# Altium project THE_HAE_Project.PrjPcb
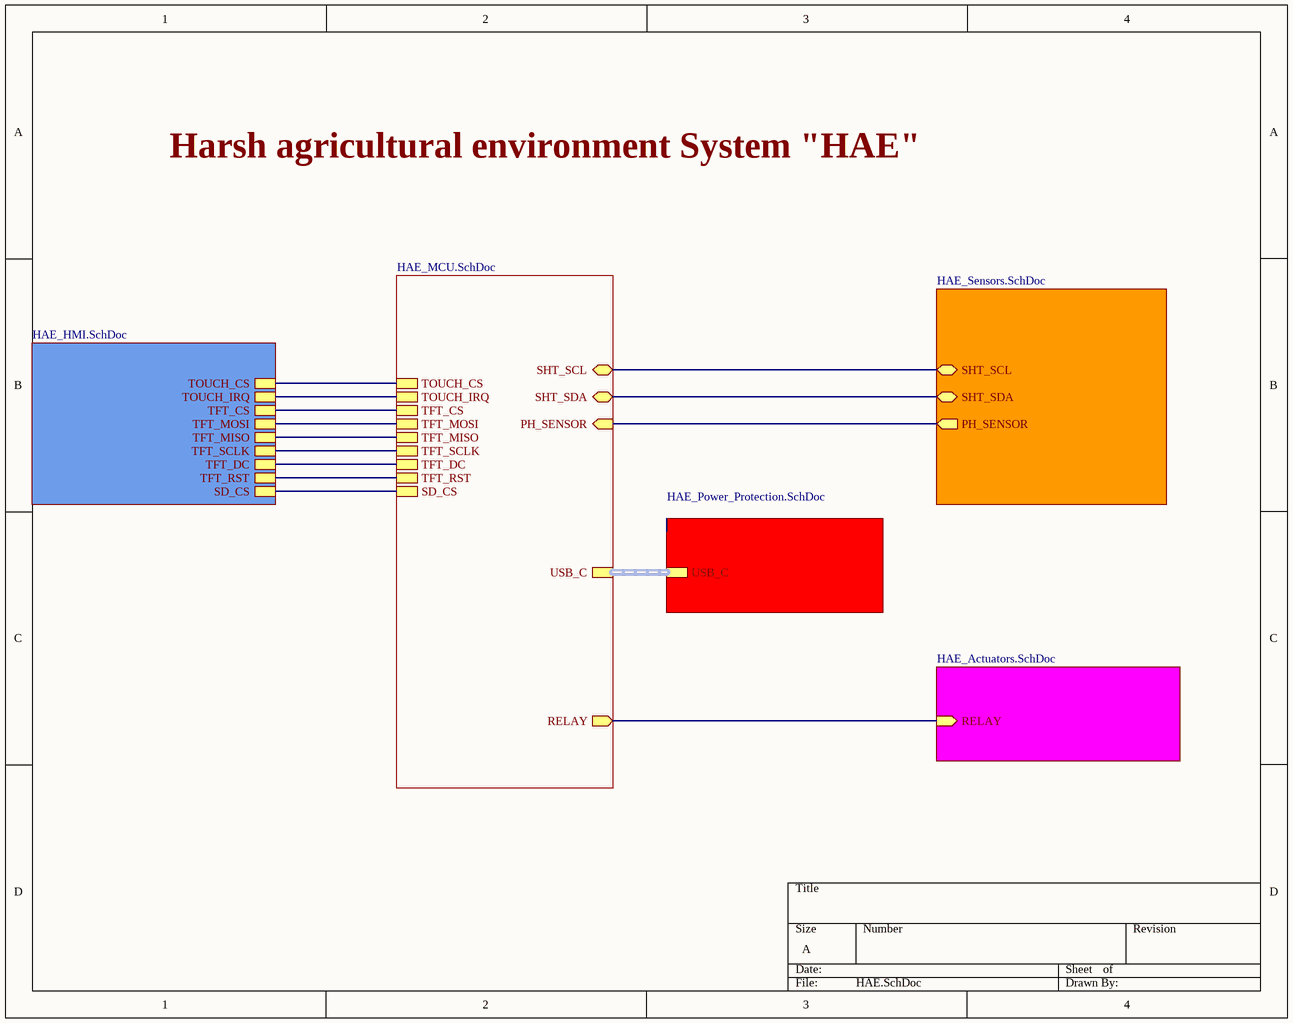
[diagram p0: HAE.SchDoc]
6 sheets, 61 parts. Net scope: hierarchical (ports join the sheet entries above them; power ports are global).
Board file: HAE_PCB.PcbDoc
Sheets:
  HAE.SchDoc
    Designator = HAE_Sensors.SchDoc
    Designator = HAE_MCU.SchDoc
    Designator = HAE_Power_Protection.SchDoc
    Designator = HAE_Actuators.SchDoc
    Designator = HAE_HMI.SchDoc

## Sheet HAE.SchDoc
size A; SheetNumber: 1; SheetTotal: 6

### Sub-sheets
Designator = HAE_Sensors.SchDoc: PH_SENSOR (out), SHT_SDA (bidir), SHT_SCL (bidir)
Designator = HAE_MCU.SchDoc: USB_C (harness USB_C), RELAY (out), TOUCH_CS, TOUCH_IRQ, TFT_CS, TFT_MOSI, TFT_MISO, TFT_SCLK, TFT_DC, TFT_RST, SD_CS, PH_SENSOR (in), SHT_SDA (bidir), SHT_SCL (bidir)
Designator = HAE_Power_Protection.SchDoc: USB_C (harness USB_C)
Designator = HAE_Actuators.SchDoc: RELAY (in)
Designator = HAE_HMI.SchDoc: TOUCH_CS, TOUCH_IRQ, TFT_CS, TFT_MOSI, TFT_MISO, TFT_SCLK, TFT_DC, TFT_RST, SD_CS

### Nets
ESP_MISO: sheet Designator/TFT_MISO, sheet Designator/TFT_MISO
ESP_MOSI: sheet Designator/TFT_MOSI, sheet Designator/TFT_MOSI
ESP_SCL: sheet Designator/SHT_SCL, sheet Designator/SHT_SCL
ESP_SCLK: sheet Designator/TFT_SCLK, sheet Designator/TFT_SCLK
ESP_SDA: sheet Designator/SHT_SDA, sheet Designator/SHT_SDA
ESP_TFT_CS: sheet Designator/TFT_CS, sheet Designator/TFT_CS
ESP_TFT_DC: sheet Designator/TFT_DC, sheet Designator/TFT_DC
ESP_TFT_RST: sheet Designator/TFT_RST, sheet Designator/TFT_RST
ESP_TOUCH_CS: sheet Designator/TOUCH_CS, sheet Designator/TOUCH_CS
ESP_TOUCH_IRQ: sheet Designator/TOUCH_IRQ, sheet Designator/TOUCH_IRQ
ESP_USB_indicate: sheet Designator/SD_CS, sheet Designator/SD_CS
Op_AmP_OUT: sheet Designator/PH_SENSOR, sheet Designator/PH_SENSOR
NetQ300_1: sheet Designator/RELAY, sheet Designator/RELAY

### Notes on the sheet
- Harsh agricultural environment System "HAE"

## Sheet HAE_Sensors.SchDoc
size A; SheetNumber: 5; SheetTotal: 6
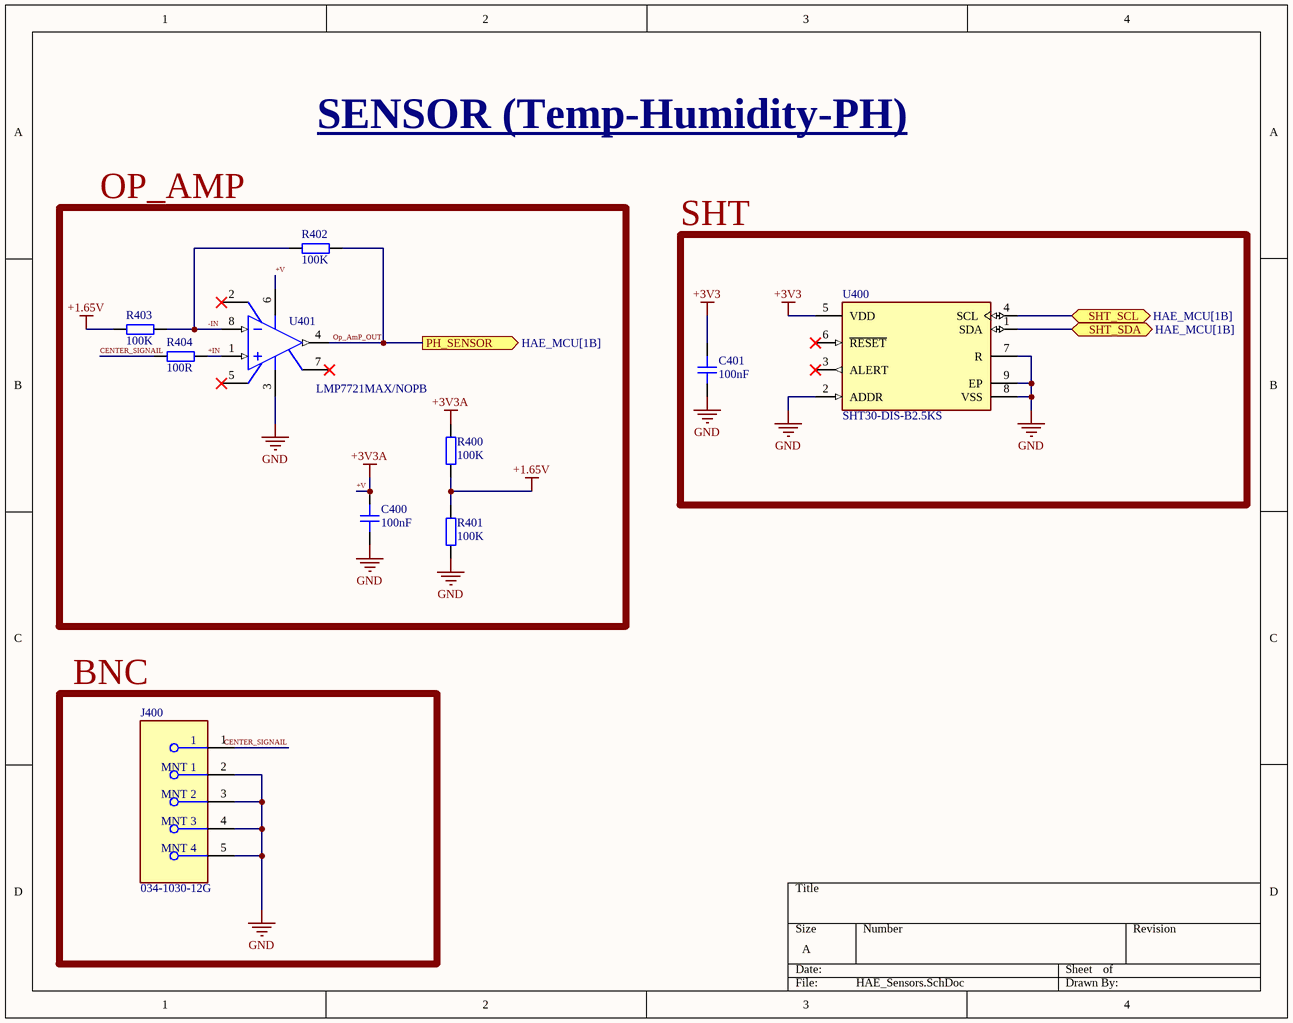
[diagram p1: HAE_Sensors.SchDoc]

### Parts
C400  100nF  [CAP_0603]
C401  100nF  [CAP_0603]
J400  034-1030-12G  [FP-034-1030-12G-MFG]
R400  100K  [RES_0402]
R401  100K  [RES_0402]
R402  100K  [RES_0402]
R403  100K  [RES_0402]
R404  100R  [RES_0402]
U400  SHT30-DIS-B2.5KS  [FP-SHT30-DIS-B2_5KS-MFG]
U401  LMP7721MAX/NOPB  [D0008A_L]

### Blocks framed on the sheet
OP_AMP: C400 R400-R404 U401
SHT: C401 U400
BNC: J400

### Ports
PH_SENSOR (out, see HAE_MCU[1B]), SHT_SCL (bidir, see HAE_MCU[1B]), SHT_SDA (bidir, see HAE_MCU[1B])

### Nets
+1.65V: R400.2 R401.1 R403.1
+3V3: C401.2 U400.5(VDD)
+V: C400.2 R400.1 U401.6(V+)  [also labelled +3V3A]
GND: C400.1 C401.1 J400.2(MNT_1) J400.3(MNT_2) J400.4(MNT_3) J400.5(MNT_4) R401.2 U400.2(ADDR) U400.7(R) U400.8(VSS) U400.9(EP) U401.3(V-)  [project net PWR_SUP1]
+IN: R404.1 U401.1(IN+)
-IN: R402.2 R403.2 U401.8(IN-)
CENTER_SIGNAIL: J400.1 R404.2
ESP_SCL: U400.4(SCL) ; port SHT_SCL
ESP_SDA: U400.1(SDA) ; port SHT_SDA
Op_AmP_OUT: R402.1 U401.4(OUT) ; port PH_SENSOR

Not connected (* = marked no-connect by the designer): U400 3(ALERT)* 6(~{RESET})*; U401 2(NC)* 5(NC)* 7(NC)*

### Notes on the sheet
- SENSOR (Temp-Humidity-PH)

### Library data of the parts
C400 C401 = CAP_0603: Capacitor SMD 0603; Manufacturer: *; Manufacturer Part Number: *; Distributor Link: *; LCSC: *; Rating: *; Dielectric: *
J400 = CMP-20040-000010-1: CONN HDBNC JACK R/A 75 OHM PCB; Connector Type: BNC; Body Plating: Nickel; Impedance: 75R; Max Frequency: 18GHz; Body Material: Brass; Dielectric Material: PTFE; Housing Color: Silver; Contact Plating: Gold; Max Operating Temperature: 165°C; Package Quantity: 100; RoHS Compliant: Yes; Packaging: Bulk; Fastening Type: Bayonet; Termination: Solder; Contact Material: Copper; Min Operating Temperature: -65°C; Mount: Through Hole
R400-R404 = RES_0402: Resistor SMD 0402; Manufacturer: *; Manufacturer Part Number: *; Distributor Link: *; LCSC: *
U400 = CMP-144040-000006-1: SENSOR HUMID/TEMP 5V I2C 3% SMD
U401 = CMP-0055-00396-3: 3 Femtoampere Input Bias Current Precision Amplifier, 8-pin Narrow SOIC, Pb-Free; Manufacturer: Texas Instruments; PackageTopMarking: NSZXTT*LMP77*21MA; PowerWise: Y; CompType: Amplifiers; ComponentLink1URL: http://www.ti.com/general/docs/lit/getliterature.tsp?genericPartNumber=LMP7721&fileType=pdf; PinCount: 8; PackageDescription: SOIC Narrow, 4.9 x 3.9 x 1.45mm, 8 Lead, 1.27mm Pitch; ComponentLink1Description: Datasheet URL; Code_JEDEC: MS-012-AA; RoHS: Y; Package Reference: D0008A; Code_IPC: SOIC127P600-8

## Sheet HAE_MCU.SchDoc
size A; SheetNumber: 3; SheetTotal: 6
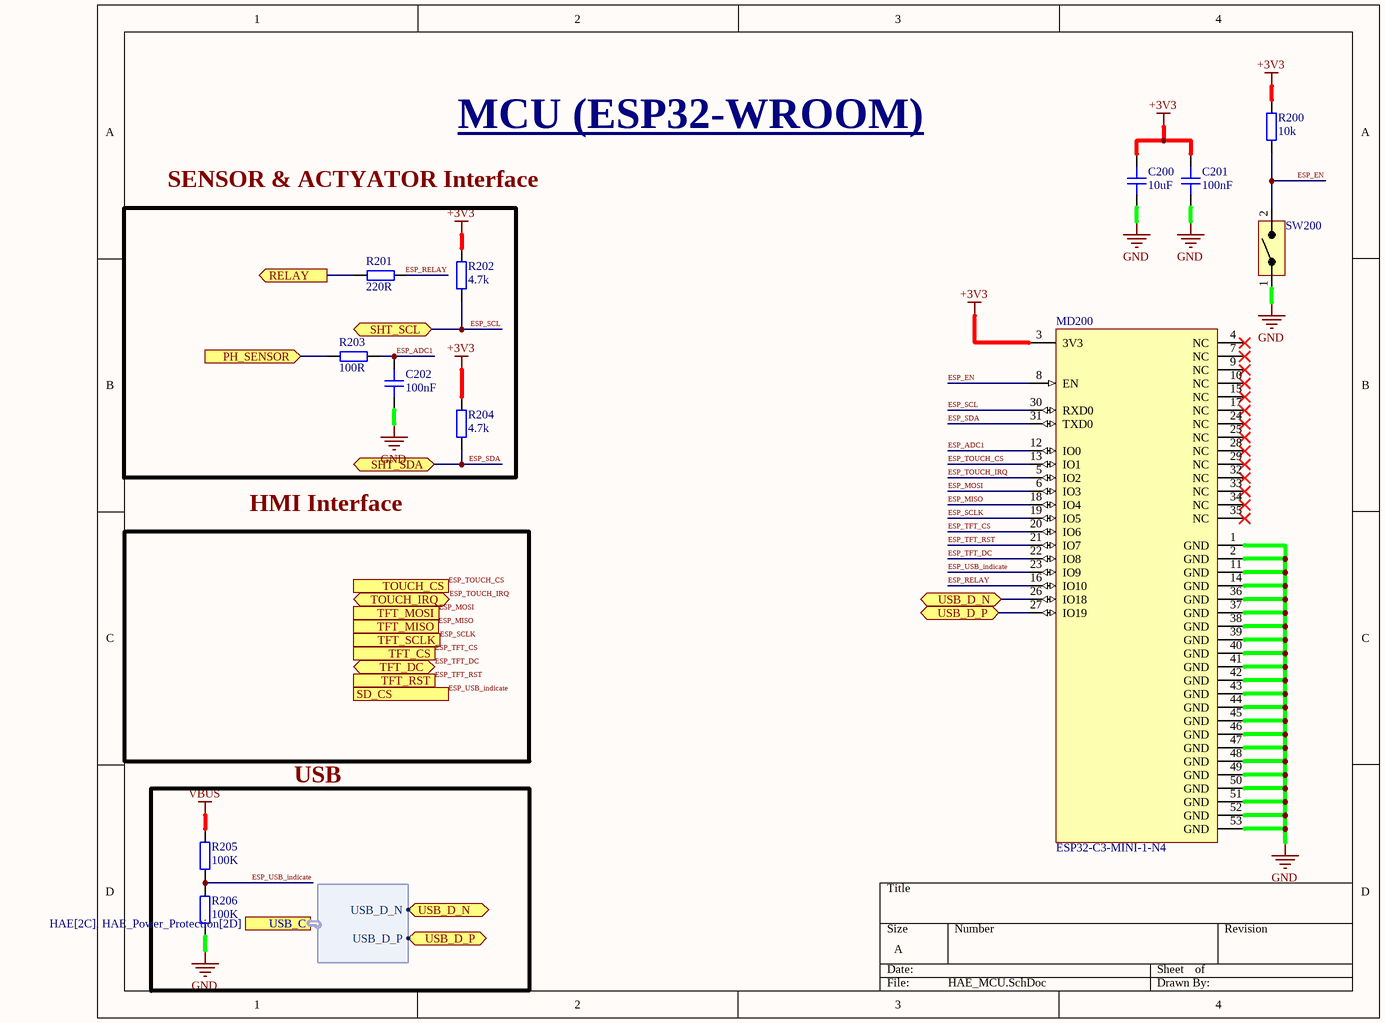
[diagram p2: HAE_MCU.SchDoc]

### Parts
C200  10uF  [CAP_0402]
C201  100nF  [CAP_0603]
C202  100nF  [CAP_0603]
MD200  ESP32-C3-MINI-1-N4  [FP-ESP32-C3-MINI-1-N4-MFG]
R200  10k  [RES_0402]
R201  220R  [RES_0402]
R202  4.7k  [RES_0402]
R203  100R  [RES_0402]
R204  4.7k  [RES_0402]
R205  100K  [RES_0402]
R206  100K  [RES_0402]
SW200  B3U-1000P  [B3U_1000P]  (value not drawn)

### Blocks framed on the sheet
SENSOR & ACTYATOR Interface: C202 R201-R204
USB: R205 R206

### Ports
PH_SENSOR (in), RELAY (out), SD_CS (out), SHT_SCL (bidir), SHT_SDA (bidir), TFT_CS (out), TFT_DC (bidir), TFT_MISO (in), TFT_MOSI (out), TFT_RST (out), TFT_SCLK (out), TOUCH_CS (out), TOUCH_IRQ (bidir), USB_C (harness USB_C, see HAE[2C], HAE_Power_Protection[2D]), USB_D_N (bidir), USB_D_P (bidir)

### Harnesses
USB_C: USB_D_N, USB_D_P

### Nets
+3V3: C200.2 C201.2 MD200.3(3V3) R200.2 R202.2 R204.2
GND: C200.1 C201.1 C202.1 MD200.1(GND) MD200.2(GND) MD200.11(GND) MD200.14(GND) MD200.36(GND) MD200.37(GND) MD200.38(GND) MD200.39(GND) MD200.40(GND) MD200.41(GND) MD200.42(GND) MD200.43(GND) MD200.44(GND) MD200.45(GND) MD200.46(GND) MD200.47(GND) MD200.48(GND) MD200.49(GND) MD200.50(GND) MD200.51(GND) MD200.52(GND) MD200.53(GND) R206.2 SW200.1  [project net PWR_SUP1]
VBUS: R205.1
ESP_ADC1: C202.2 MD200.12(IO0) R203.1
ESP_EN: MD200.8(EN) R200.1 SW200.2
ESP_MISO: MD200.18(IO4) ; port TFT_MISO
ESP_MOSI: MD200.6(IO3) ; port TFT_MOSI
ESP_RELAY: MD200.16(IO10) R201.1
ESP_SCL: MD200.30(RXD0) R202.1 ; port SHT_SCL
ESP_SCLK: MD200.19(IO5) ; port TFT_SCLK
ESP_SDA: MD200.31(TXD0) R204.1 ; port SHT_SDA
ESP_TFT_CS: MD200.20(IO6) ; port TFT_CS
ESP_TFT_DC: MD200.22(IO8) ; port TFT_DC
ESP_TFT_RST: MD200.21(IO7) ; port TFT_RST
ESP_TOUCH_CS: MD200.13(IO1) ; port TOUCH_CS
ESP_TOUCH_IRQ: MD200.5(IO2) ; port TOUCH_IRQ
ESP_USB_indicate: MD200.23(IO9) R205.2 R206.1 ; port SD_CS
Op_AmP_OUT: R203.2 ; port PH_SENSOR
USB_D_N: MD200.26(IO18) ; port USB_D_N, port USB_C.USB_D_N
USB_D_P: MD200.27(IO19) ; port USB_D_P, port USB_C.USB_D_P
NetQ300_1: R201.2 ; port RELAY

Not connected (* = marked no-connect by the designer): MD200 4(NC)* 7(NC)* 9(NC)* 10(NC)* 15(NC)* 17(NC)* 24(NC)* 25(NC)* 28(NC)* 29(NC)* 32(NC)* 33(NC)* 34(NC)* 35(NC)*

### Notes on the sheet
- MCU (ESP32-WROOM)
- HMI Interface

### Library data of the parts
C200 = CAP_0402: Capacitor SMD 0402; Manufacturer: *; Manufacturer Part Number: *; Distributor Link: *; LCSC: *; Rating: *; Dielectric: *
C201 C202 = CAP_0603: Capacitor SMD 0603; Manufacturer: *; Manufacturer Part Number: *; Distributor Link: *; LCSC: *; Rating: *; Dielectric: *
MD200 = CMP-10700-116589975-1: Multiprotocol Modules SMD module, ESP32-C3FN4, PCB antenna, -40 C +85 C; Max Frequency: 2.484GHz; Min Supply Voltage: 3V; Current - Transmitting: 350mA; Interface: SPI; Data Rate: 150Mbps; Max Supply Voltage: 3.6V; Number of GPIO: 13; Current - Receiving: 84mA; Min Operating Temperature: -40°C; Height: 2.55mm; Ambient Temperature Range High: 85°C; Max Operating Temperature: 85°C
R200-R206 = RES_0402: Resistor SMD 0402; Manufacturer: *; Manufacturer Part Number: *; Distributor Link: *; LCSC: *
SW200 = B3U-1000P: Tactile Switch SPST-NO Top Actuated Surface Mount; Manufacturer: Omron; Mechanical Life: 200000Cycles; Contact Current Rating: 50mA; Operating Force: 1.5N; Throw Configuration: SPST; Voltage Rating (DC): 12V; Contact Resistance: 100mR; Illumination Type: Non-Illuminated,Illuminated; Switch Travel: 0.15mm; Switch Function: Off-Mom; Actuator Length: 0.4mm; IP Rating: IP40,Dust Proof; Supplier 1: Digi-Key; Manufacturer Part Number: B3U-1000P; Stock 1: 104895; Pricing 1: 1=1, 10=0.961, 25=0.9064, 50=0.7976, 100=0.7251, 250=0.6889, 500=0.6707, 1000=0.5257 (USD); Mount: Surface Mount; Weight: 0.000776oz; Contact Material: Silver; Min Operating Temperature: -25°C; Max Operating Temperature: 70°C; Max Current Rating: 50mA; Packaging: Tape and Reel; Package Quantity: 1; Max Voltage Rating (DC): 12V; Current Rating: 50mA; Termination: SMD/SMT; Electrical Life: 200000Cycles; Insulation Resistance: 100MR; Orientation: Straight; Length: 4mm; Height: 1.2mm; Width: 3mm; Depth: 2.5mm; REACH SVHC: Unknown; Lead Free: Lead Free; ComponentLink1URL: https://datasheet.ciiva.com/26917/getdatasheetpartid-552554-26917552.pdf; ComponentLink1Description: https://datasheet.ciiva.com/26917/getdatasheetpartid-552554-26917552.pdf; ComponentLink2URL: https://datasheet.ciiva.com/22696/1685550-22696214.pdf; ComponentLink2Description: https://datasheet.ciiva.com/22696/1685550-22696214.pdf; ComponentLink3URL: https://datasheet.ciiva.com/1532/1685550-1532680.pdf; ComponentLink3Description: https://datasheet.ciiva.com/1532/1685550-1532680.pdf; ComponentLink4URL: https://datasheet.ciiva.com/1634/1685550-1634396.pdf; ComponentLink4Description: https://datasheet.ciiva.com/1634/1685550-1634396.pdf; ComponentLink5URL: https://datasheet.ciiva.com/14142/b3u-eng-datasheet-14142540.pdf; ComponentLink5Description: https://datasheet.ciiva.com/14142/b3u-eng-datasheet-14142540.pdf; ComponentLink6URL: https://datasheet.ciiva.com/2900/b3u-1110-2900029.pdf; ComponentLink6Description: https://datasheet.ciiva.com/2900/b3u-1110-2900029.pdf; ComponentLink7URL: https://datasheet.ciiva.com/16155/en-b3u-16155021.pdf; ComponentLink7Description: https://datasheet.ciiva.com/16155/en-b3u-16155021.pdf; ComponentLink8URL: https://datasheet.ciiva.com/2900/b3u-1110-2900030.pdf; ComponentLink8Description: https://datasheet.ciiva.com/2900/b3u-1110-2900030.pdf; ComponentLink9URL: https://datasheet.ciiva.com/16862/70176037-16862846.pdf; ComponentLink9Description: https://datasheet.ciiva.com/16862/70176037-16862846.pdf; ComponentLink10URL: https://datasheet.ciiva.com/2900/b3u-1110-2900031.pdf; ComponentLink10Description: https://datasheet.ciiva.com/2900/b3u-1110-2900031.pdf; Supplier Part Number 1: SW1020DKR-ND

## Sheet HAE_Power_Protection.SchDoc
size A; SheetNumber: 2; SheetTotal: 6
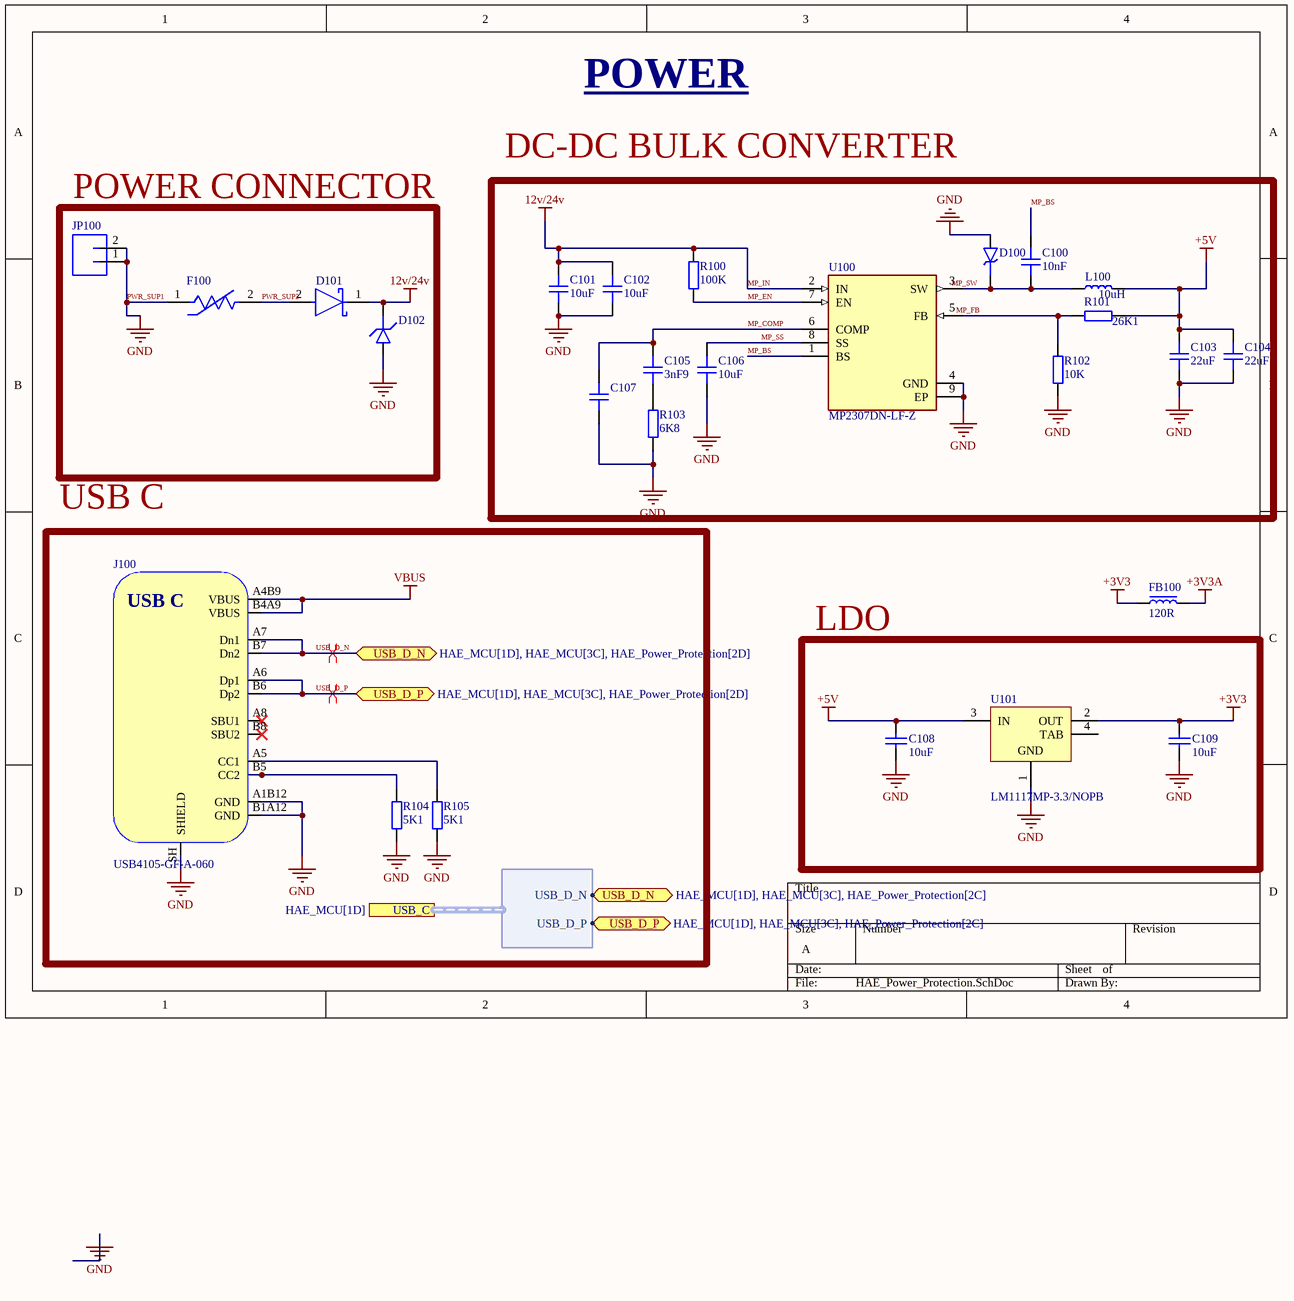
[diagram p3: HAE_Power_Protection.SchDoc]

### Parts
C100  10nF  [CAP_0603]
C101  10uF  [CAP_0603]
C102  10uF  [CAP_0603]
C103  22uF  [CAP_0603]
C104  22uF  [CAP_0603]
C105  3nF9  [CAP_0603]
C106  10uF  [CAP_0603]
C107  10uF  [CAP_0603]  (value not drawn)
C108  10uF  [CAPC2014X60X15NL20]
C109  10uF  [CAPC2014X60X15NL20]
D100  D_ZENER_SOD_323  [SOD-323]  (value not drawn)
D101  SS34-E3/9AT  [FP-SMC-MFG]  (value not drawn)
D102  D_TVS_0402  [D_0402]  (value not drawn)
F100  MF-PSMF020X-2  [FP-MF-PSMF-MFG]  (value not drawn)
FB100  120R  [FB_0603]
J100  USB4105-GF-A-060  [USB4105-GF-A-060]
JP100  MOLEX_MICROFIT_2_SMD_HORZ  [MOLEX-MICROFIT-2-SMD-HORZ]  (value not drawn)
L100  10uH  [IND_0603]
R100  100K  [RES_0603]
R101  26K1  [RES_0603]
R102  10K  [RES_0603]
R103  6K8  [RES_0603]
R104  5K1  [RES_0402]
R105  5K1  [RES_0402]
U100  MP2307DN-LF-Z  [SOIC127P600X170-9N]
U101  LM1117MP-3.3/NOPB  [DCY0004A_L]

### Blocks framed on the sheet
DC-DC BULK CONVERTER: C100-C107 D100 L100 R100-R103 U100
POWER CONNECTOR: D101 D102 F100 JP100
USB C: J100 R104 R105
LDO: C108 C109 U101

### Ports
USB_C (harness USB_C, see HAE_MCU[1D]), USB_D_N (bidir, see HAE_MCU[1D], HAE_MCU[3C], HAE_Power_Protection[2C]), USB_D_N (bidir, see HAE_MCU[1D], HAE_MCU[3C], HAE_Power_Protection[2D]), USB_D_P (bidir, see HAE_MCU[1D], HAE_MCU[3C], HAE_Power_Protection[2C]), USB_D_P (bidir, see HAE_MCU[1D], HAE_MCU[3C], HAE_Power_Protection[2D])

### Harnesses
USB_C: USB_D_N, USB_D_P

### Nets
+3V3: C109.2 FB100.1 U101.2(OUT)
+3V3A: FB100.2  [project net +V]
+5V: C103.2 C104.2 C108.2 L100.2 R101.1 U101.3(IN)
MP_IN: C101.2 C102.2 D101.1(C) D102.K R100.2 U100.2(IN)  [also labelled 12v/24v]
PWR_SUP1: C101.1 C102.1 C103.1 C104.1 C106.1 C107.1 C108.1 C109.1 D100.A D102.A F100.1 J100.A1B12(GND) J100.B1A12(GND) J100.SH(SHIELD) JP100.1 JP100.2 R102.1 R103.1 R104.1 R105.1 U100.4(GND) U100.9(EP) U101.1(GND)  [also labelled GND]
VBUS: J100.A4B9(VBUS) J100.B4A9(VBUS)
MP_BS: C100.1 U100.1(BS)
MP_COMP: C105.2 C107.2 U100.6(COMP)
MP_EN: R100.1 U100.7(EN)
MP_FB: R101.2 R102.2 U100.5(FB)
MP_SS: C106.2 U100.8(SS)
MP_SW: C100.2 D100.K L100.1 U100.3(SW)
PWR_SUP2: D101.2(A) F100.2
USB_D_N: J100.A7(Dn1) J100.B7(Dn2) ; port USB_D_N, port USB_C.USB_D_N
USB_D_P: J100.A6(Dp1) J100.B6(Dp2) ; port USB_D_P, port USB_C.USB_D_P
NetC105_1: C105.1 R103.2
NetJ100_A5: J100.A5(CC1) R105.2
NetJ100_B5: J100.B5(CC2) R104.2

Not connected (* = marked no-connect by the designer): J100 A8(SBU1)* B8(SBU2)*; U101 4(TAB)

### Layout directives
differential pair; differential pair class USB: USB_D_N, USB_D_P

### Notes on the sheet
- POWER
- (in symbol USB4105-GF-A-060) USB C

### Library data of the parts
C100-C107 = CAP_0603: Capacitor SMD 0603; Manufacturer: *; Manufacturer Part Number: *; Distributor Link: *; LCSC: *; Rating: *; Dielectric: *
C108 C109 = CMP-2007-00011-1: TACH106M010XTA; Manufacturer: AVX Interconnect / Elco; Part Number: TACH106M010XTA
D100 = D_ZENER_SOD_323: Diode Zener SMD SOD-323
D101 = CMP-02539-000066-1: DIODE SCHOTTKY 40V 3A DO214AB; Peak Non-Repetitive Surge Current: 100A; Forward Voltage: 500mV; Element Configuration: Single; Max Reverse Current: 500uA; Case/Package: SMC; Radiation Hardening: No; Series: -; Max Surge Current: 100A; RoHS Compliant: Yes; Min Operating Temperature: -55°C; Average Rectified Current: 3A; Max Reverse Leakage Current: 500uA; Package Quantity: 3500; Max Reverse Voltage (DC): 40V; Forward Current: 3A; Packaging: Tape and Reel; Max Operating Temperature: 125°C; Max Repetitive Reverse Voltage (Vrrm): 40V; Number of Pins: 2; Mount: Surface Mount
D102 = D_TVS_0402: Diode TVS / ESD 0402
F100 = CMP-07400-000005-1: PTC RESET FUSE 9V 200MA 0805; Manufacturer: Bourns; Trip Current: 0.5A; Resistance: 0.65-3.5Ω; Current Rating: 40A; Value: 0.65-3.5Ω; Trip Time: 0.02s; Hold Current: 0.2A; ComponentLink2Description: Datasheet; Manufacturer Part Number: MF-PSMF020X-2; Height: 0.85mm; Ambient Temperature Range High: +85°C; Category: Fuse; Temperature Range Low: -40°C; ComponentLink2URL: https://www.bourns.com/docs/Product-Datasheets/mfpsmf.pdf; Temperature Range High: +85°C; RoHS: TRUE; Device Class L1: Circuit Protection; Device Class L3: unset; Package: MF-PSMF; Digikey Description: PTC RESET FUSE 9V 200MA 0805; Mouser Description: PTC Resettable Fuse 0.2A(hold) 0.5A(trip) 9V 40A 0.5W 0.02s 0.65Ohm SMD Solder Pad 0805 T/R; Voltage Rating: 9V; Automotive: No; Device Class L2: PTC Resettable Fuses; Temperature: -40°C to +85°C; Lead Free: Yes; Octopart: https://octopart.com/mf-psmf020x-2-bourns-7483437; Ambient Temperature Range Low: -40°C
FB100 = FB_0603: Ferrite Bead SMD 0603; Manufacturer: *; Manufacturer Part Number: *; Distributor Link: *; LCSC: *
J100 = USB4105-GF-A-060: USB Connector Type C SMT 12 Pin; Manufacturer: GCT; Manufacturer Part Number: USB4105-GF-A-060; Distributor Link: https://eu.mouser.com/ProductDetail/GCT/USB4105-GF-A-060?qs=QNEnbhJQKvY2mocwNJzgfA%3D%3D
JP100 = MOLEX_MICROFIT_2_SMD_HORZ: Manufacturer: Molex; PartNumber: 43650-0212; Mounting Technology: Surface Mount; PackageReference: Microfit-3.0mm
L100 = IND_0603: Inductor SMD 0603
R100-R103 = RES_0603: Resistor SMD 0603; Manufacturer: *; Manufacturer Part Number: *; Distributor Link: *; LCSC: *
R104 R105 = RES_0402: Resistor SMD 0402; Manufacturer: *; Manufacturer Part Number: *; Distributor Link: *; LCSC: *
U100 = MP2307DN-LF-Z: Buck Switching Regulator IC Positive Adjustable 0.925V 1 Output 3A 8-SOIC (0.154, 3.90mm Width) Exposed Pad; MF: Monolithic Power; Check_prices: https://www.snapeda.com/parts/MP2307DN-LF-Z/Monolithic+Power+Systems+Inc./view-part/?ref=eda; SnapEDA_Link: https://www.snapeda.com/parts/MP2307DN-LF-Z/Monolithic+Power+Systems+Inc./view-part/?ref=snap; Availability: In Stock; Value: *; Price: None; MP: MP2307DN-LF-Z; Package: SOIC-8 Monolithic Power; Purchase-URL: https://pricing.snapeda.com/search/part/MP2307DN-LF-Z/?ref=eda
U101 = CMP-0062-01638-4: 800mA Low-Dropout Linear Regulator, 4-pin SOT-223, Pb-Free; Manufacturer: Texas Instruments; CompType: LDO IC; PackageTopMarking: XYTT*N05A; High-Reliability: Y; PowerWise: N; ComponentLink1URL: http://www.ti.com/general/docs/lit/getliterature.tsp?genericPartNumber=LM1117-N&fileType=pdf; PinCount: 4; PackageDescription: Molded SOT-223, 6.50 x 3.56 x 1.6mm Body, 4 Lead, 2.3mm Pitch; Code_IPC: SOT223-4; PartNumber: LM1117MP-3.3/NOPB; Code_JEDEC: TO-261-AA; RoHS: Y; PackageReference: DCY0004A; ComponentLink1Description: Datasheet URL

## Sheet HAE_Actuators.SchDoc
size A; SheetNumber: 4; SheetTotal: 6
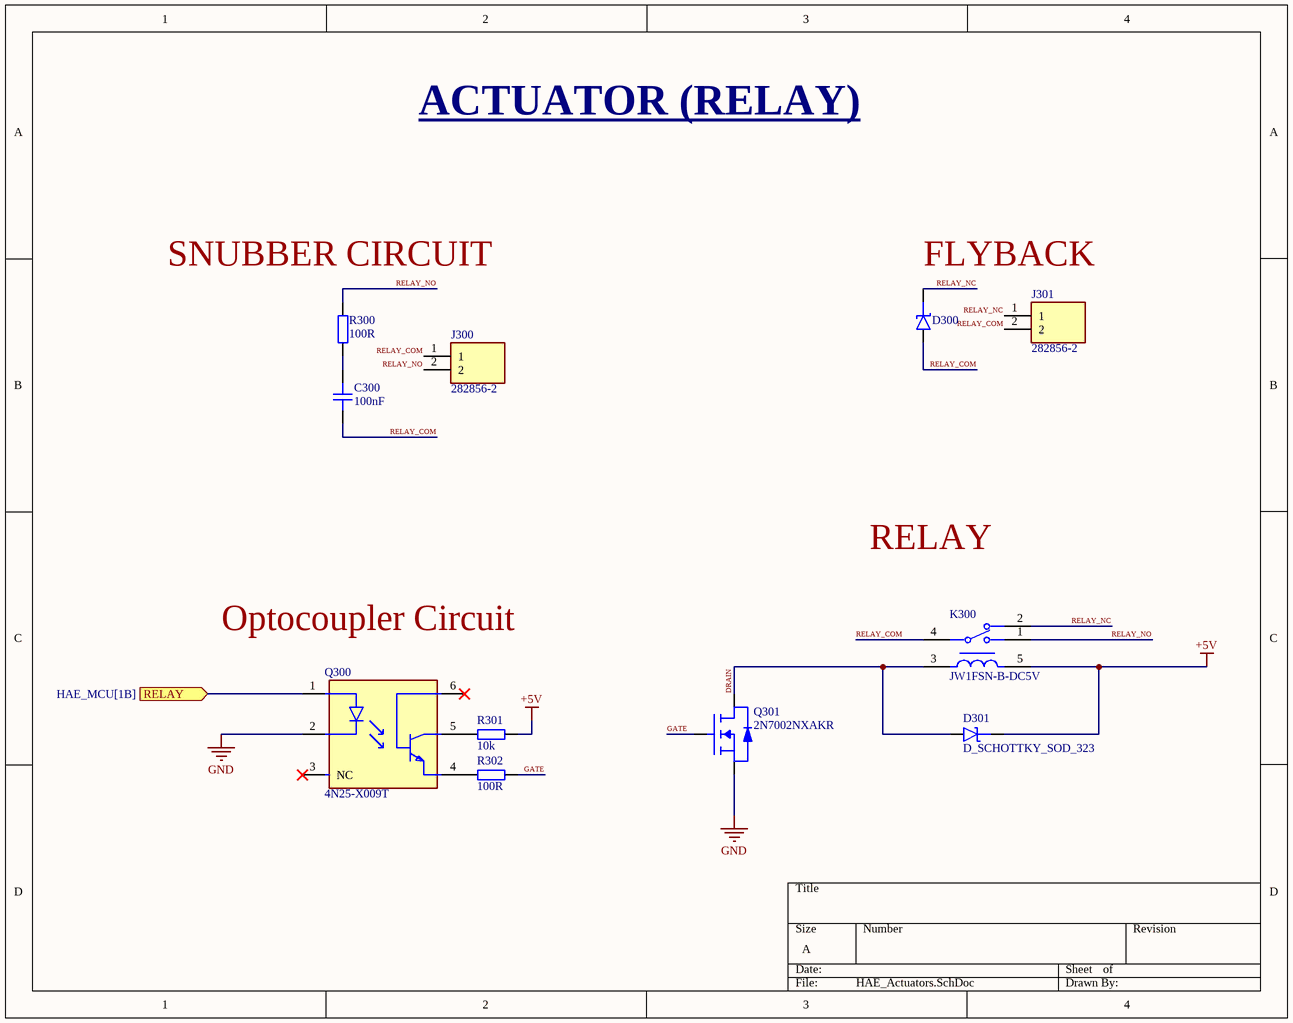
[diagram p4: HAE_Actuators.SchDoc]

### Parts
C300  100nF  [CAP_0603]
D300  D_SCHOTTKY_SOD_323  [SOD-323]  (value not drawn)
D301  D_SCHOTTKY_SOD_323  [SOD-323]
J300  282856-2  [TE_282856-2]
J301  282856-2  [TE_282856-2]
K300  JW1FSN-B-DC5V  [FP-JW1FSN-B-DC5V-MFG]
Q300  4N25-X009T  [FP-4N25-X009T-MFG]
Q301  2N7002NXAKR  [SSM3J338R,LF-SOT23-F]
R300  100R  [RES_0402]
R301  10k  [RES_0402]
R302  100R  [RES_0402]

### Ports
RELAY (in, see HAE_MCU[1B])

### Nets
+5V: D301.K K300.5 R301.2
GND: Q300.2(C) Q301.S  [project net PWR_SUP1]
DRAIN: D301.A K300.3 Q301.D
GATE: Q301.G R302.2
RELAY_COM: C300.1 D300.A J300.1 J301.2 K300.4
RELAY_NC: D300.K J301.1 K300.2
RELAY_NO: J300.2 K300.1 R300.1
NetC300_2: C300.2 R300.2
NetQ300_1: Q300.1(A) ; port RELAY
NetQ300_4: Q300.4(E) R302.1
NetQ300_5: Q300.5(C) R301.1

Not connected (* = marked no-connect by the designer): Q300 3(NC)* 6(B)*

### Notes on the sheet
- ACTUATOR (RELAY)
- (near R300) SNUBBER CIRCUIT
- FLYBACK
- RELAY
- Optocoupler Circuit

### Library data of the parts
C300 = CAP_0603: Capacitor SMD 0603; Manufacturer: *; Manufacturer Part Number: *; Distributor Link: *; LCSC: *; Rating: *; Dielectric: *
D300 D301 = D_SCHOTTKY_SOD_323: Diode Schottky SMD SOD-323
J300 J301 = 282856-2: TERMI-BLOK PCB MOUNT 2P; MF: TE Connectivity; Purchase-URL: https://pricing.snapeda.com/search/part/282856-2/?ref=eda; Package: None; MP: 282856-2; EU_RoHS_Compliance: Compliant with Exemptions; Price: None; Availability: In Stock; Value: *; Check_prices: https://www.snapeda.com/parts/282856-2/TE+Connectivity+AMP+Connectors/view-part/?ref=eda; SnapEDA_Link: https://www.snapeda.com/parts/282856-2/TE+Connectivity+AMP+Connectors/view-part/?ref=snap
K300 = CMP-05606-000101-1: RELAY GEN PURPOSE SPDT 10A 5V; Ratings: IP67; Operate Time: 15ms; Coil Type: Non-Latching; Max Voltage Rating (DC): 30V; Voltage Rating (AC): 250V; Coil Current: 106mA; Coil Resistance: 47R; Relay Type: General Purpose; Switching Capacity: 300W; Test Voltage: 5kV; Power Consumption: 530mW; Release Time: 5ms; Length: 28.6mm; Mount: Through Hole; Min Operating Temperature: -40°C; Package Quantity: 100; RoHS Compliant: Yes; Max Current Rating: 10A; Coil Voltage (DC): 5V; Series: JW; Switching Current: 10A; Contact Material: Silver; Throw Configuration: SPDT; Packaging: Bulk; Voltage Rating (DC): 30V; Contact Current Rating: 10A; Max Voltage Rating (AC): 250V; Depth: 12.8mm; Termination: PC Pin; Number of Pins: 5; Lead Free: Lead Free; Max Operating Temperature: 85°C; Coil Power: 530mW; Radiation Hardening: No
Q300 = CMP-00030-12292229-1: 4N25-X009T Optocoupler DC-IN 1-CH Transistor With Base DC-OUT 6-Pin PDIP SMD T/R; Max Collector Current: 100mA; Number of Channels: 1; Forward Current: 60mA; Collector Emitter Saturation Voltage: 500mV; Collector Emitter Voltage (VCEO): 70V; Output Current per Channel: 50mA; Current Transfer Ratio: 50%; Max Power Dissipation: 150mW; Forward Voltage: 1.36V; Reverse Breakdown Voltage: 6V; NexarPartId: 12292229; Radiation Hardening: No; Min Operating Temperature: -55°C; Packaging: Tape & Reel (TR); Lead Free: Lead Free; Number of Pins: 6; Max Output Voltage: 70V; RoHS: Compliant; Contact Plating: Tin; Case/Package: SMD/SMT; Number of Elements: 1; Max Operating Temperature: 100°C; Mount: Surface Mount; Power Dissipation: 150mW; Max Input Current: 60mA
Q301 = 2N7002NXAKR: MOSFET N-Channel Vds=60V Id=300mA with ESD Protection; Manufacturer: Nexperia; Manufacturer Part Number: 2N7002NXAKR
R300-R302 = RES_0402: Resistor SMD 0402; Manufacturer: *; Manufacturer Part Number: *; Distributor Link: *; LCSC: *

## Sheet HAE_HMI.SchDoc
size A; SheetNumber: 6; SheetTotal: 6
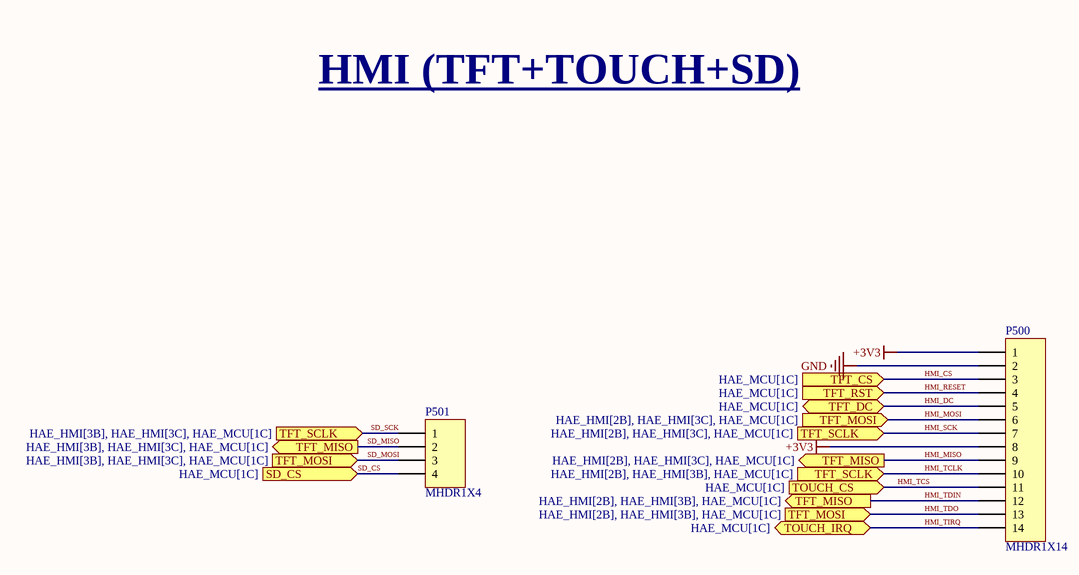
[diagram p5: HAE_HMI.SchDoc]

### Parts
P500  MHDR1X14  [MHDR1X14]
P501  MHDR1X4  [MHDR1X4]

### Ports
SD_CS (in, see HAE_MCU[1C]), TFT_CS (in, see HAE_MCU[1C]), TFT_DC (bidir, see HAE_MCU[1C]), TFT_MISO (out, see HAE_HMI[2B], HAE_HMI[3B], HAE_MCU[1C]), TFT_MISO (out, see HAE_HMI[2B], HAE_HMI[3C], HAE_MCU[1C]), TFT_MISO (out, see HAE_HMI[3B], HAE_HMI[3C], HAE_MCU[1C]), TFT_MOSI (in, see HAE_HMI[2B], HAE_HMI[3B], HAE_MCU[1C]), TFT_MOSI (in, see HAE_HMI[2B], HAE_HMI[3C], HAE_MCU[1C]), TFT_MOSI (in, see HAE_HMI[3B], HAE_HMI[3C], HAE_MCU[1C]), TFT_RST (in, see HAE_MCU[1C]), TFT_SCLK (in, see HAE_HMI[2B], HAE_HMI[3B], HAE_MCU[1C]), TFT_SCLK (in, see HAE_HMI[2B], HAE_HMI[3C], HAE_MCU[1C]), TFT_SCLK (in, see HAE_HMI[3B], HAE_HMI[3C], HAE_MCU[1C]), TOUCH_CS (in, see HAE_MCU[1C]), TOUCH_IRQ (bidir, see HAE_MCU[1C])

### Nets
+3V3: P500.1 P500.8
GND: P500.2  [project net PWR_SUP1]
HMI_CS: P500.3 ; port TFT_CS  [project net ESP_TFT_CS]
HMI_DC: P500.5 ; port TFT_DC  [project net ESP_TFT_DC]
HMI_MISO: P500.9 P500.12 P501.2 ; port TFT_MISO  [also labelled HMI_TDIN, SD_MISO]  [project net ESP_MISO]
HMI_MOSI: P500.6 P500.13 P501.3 ; port TFT_MOSI  [also labelled HMI_TDO, SD_MOSI]  [project net ESP_MOSI]
HMI_RESET: P500.4 ; port TFT_RST  [project net ESP_TFT_RST]
HMI_SCK: P500.7 P500.10 P501.1 ; port TFT_SCLK  [also labelled HMI_TCLK, SD_SCK]  [project net ESP_SCLK]
HMI_TCS: P500.11 ; port TOUCH_CS  [project net ESP_TOUCH_CS]
HMI_TIRQ: P500.14 ; port TOUCH_IRQ  [project net ESP_TOUCH_IRQ]
SD_CS: P501.4 ; port SD_CS  [project net ESP_USB_indicate]

### Notes on the sheet
- HMI (TFT+TOUCH+SD)

### Library data of the parts
P500 = MHDR1X14: Header, 14-Pin; LatestRevisionDate: 17-Jul-2002; LatestRevisionNote: Re-released for DXP Platform.; Publisher: Altium Limited
P501 = MHDR1X4: Header, 4-Pin; LatestRevisionDate: 17-Jul-2002; LatestRevisionNote: Re-released for DXP Platform.; Publisher: Altium Limited

## Nets that join several sheets
+3V3: HAE_Sensors (C401.2 U400.5), HAE_MCU (6 pins), HAE_Power_Protection (C109.2 FB100.1 U101.2), HAE_HMI (P500.1 P500.8)
+5V: HAE_Power_Protection (6 pins), HAE_Actuators (D301.K K300.5 R301.2)
+V: HAE_Sensors (C400.2 R400.1 U401.6), HAE_Power_Protection (FB100.2)
PWR_SUP1: HAE_Sensors (12 pins), HAE_MCU (27 pins), HAE_Power_Protection (23 pins), HAE_Actuators (Q300.2 Q301.S), HAE_HMI (P500.2)
VBUS: HAE_MCU (R205.1), HAE_Power_Protection (J100.A4B9 J100.B4A9)
ESP_MISO: HAE_MCU (MD200.18), HAE_HMI (P500.9 P500.12 P501.2)
ESP_MOSI: HAE_MCU (MD200.6), HAE_HMI (P500.6 P500.13 P501.3)
ESP_SCL: HAE_Sensors (U400.4), HAE_MCU (MD200.30 R202.1)
ESP_SCLK: HAE_MCU (MD200.19), HAE_HMI (P500.7 P500.10 P501.1)
ESP_SDA: HAE_Sensors (U400.1), HAE_MCU (MD200.31 R204.1)
ESP_TFT_CS: HAE_MCU (MD200.20), HAE_HMI (P500.3)
ESP_TFT_DC: HAE_MCU (MD200.22), HAE_HMI (P500.5)
ESP_TFT_RST: HAE_MCU (MD200.21), HAE_HMI (P500.4)
ESP_TOUCH_CS: HAE_MCU (MD200.13), HAE_HMI (P500.11)
ESP_TOUCH_IRQ: HAE_MCU (MD200.5), HAE_HMI (P500.14)
ESP_USB_indicate: HAE_MCU (MD200.23 R205.2 R206.1), HAE_HMI (P501.4)
NetQ300_1: HAE_MCU (R201.2), HAE_Actuators (Q300.1)
Op_AmP_OUT: HAE_Sensors (R402.1 U401.4), HAE_MCU (R203.2)
USB_D_N: HAE_MCU (MD200.26), HAE_Power_Protection (J100.A7 J100.B7)
USB_D_P: HAE_MCU (MD200.27), HAE_Power_Protection (J100.A6 J100.B6)